# EAGLE design button_control_esp32 (EAGLE 8.6.0)

## Sheet 1 of 7
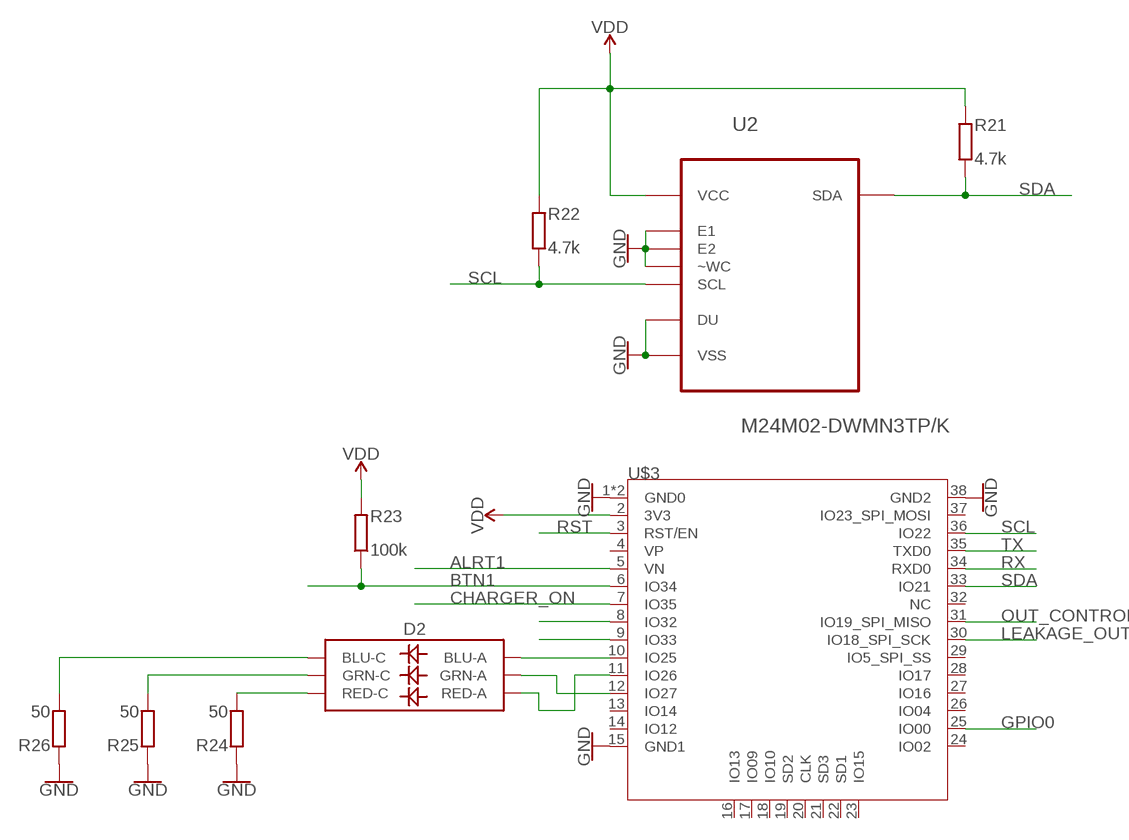
[diagram p0: schematic, sheet 1]

### Parts
D2  LED-RGBNO_IC  [LED-TRICOLOR-5050]
R21  4.7k  R-EU_R0603  [R0603]
R22  4.7k  R-EU_R0603  [R0603]
R23  100k  R-EU_R0603  [R0603]
R24  50  R-EU_R0603  [R0603]
R25  50  R-EU_R0603  [R0603]
R26  50  R-EU_R0603  [R0603]
U2  M24M02-DWMN3TP/K  [SOIC127P600X175-8N]
U$3  ESP32  [TTGO_ESP32]

### Nets
ALRT1: U$3.5(VN) ; also sheet 5
BTN1: R23.1 U$3.6(IO34) ; also sheet 7
CHARGER_ON: U$3.7(IO35) ; also sheet 6
GND [PWR]: R24.2 R25.2 R26.2 U2.1(DU) U2.2(E1) U2.3(E2) U2.4(VSS) U2.7(~WC) U$3.1(GND0) U$3.15(GND1) U$3.38(GND2) U$3.P$1(GND0) ; also sheet 2,3,4,6,7
GPIO0: U$3.25(IO00) ; also sheet 7
LEAKAGE_OUT: U$3.30(IO18_SPI_SCK) ; also sheet 3
N$4: D2.3(BLU-A) U$3.10(IO25)
N$12: D2.1(GRN-A) U$3.12(IO27)
N$19: D2.2(RED-A) U$3.11(IO26)
N$24: U$3.9(IO33)
N$30: U$3.8(IO32)
N$31: D2.4(BLU-C) R26.1
N$33: D2.6(GRN-C) R25.1
N$34: D2.5(RED-C) R24.1
OUT_CONTROL: U$3.31(IO19_SPI_MISO) ; also sheet 6
RST: U$3.3(RST/EN) ; also sheet 7
RX: U$3.34(RXD0) ; also sheet 7
SCL: R22.1 U2.6(SCL) U$3.36(IO22) ; also sheet 5
SDA: R21.1 U2.5(SDA) U$3.33(IO21) ; also sheet 5
TX: U$3.35(TXD0) ; also sheet 7
VDD [PWR]: R21.2 R22.2 R23.2 U2.8(VCC) U$3.2(3V3) ; also sheet 2,3,6,7
Unconnected: U$3.4(VP) U$3.13(IO14) U$3.14(IO12) U$3.16(IO13) U$3.17(IO09) U$3.18(IO10) U$3.19(SD2) U$3.20(CLK) U$3.21(SD3) U$3.22(SD1) U$3.23(IO15) U$3.24(IO02) U$3.26(IO04) U$3.27(IO16) U$3.28(IO17) U$3.29(IO5_SPI_SS) U$3.32(NC) U$3.37(IO23_SPI_MOSI)

## Sheet 2 of 7: POWER
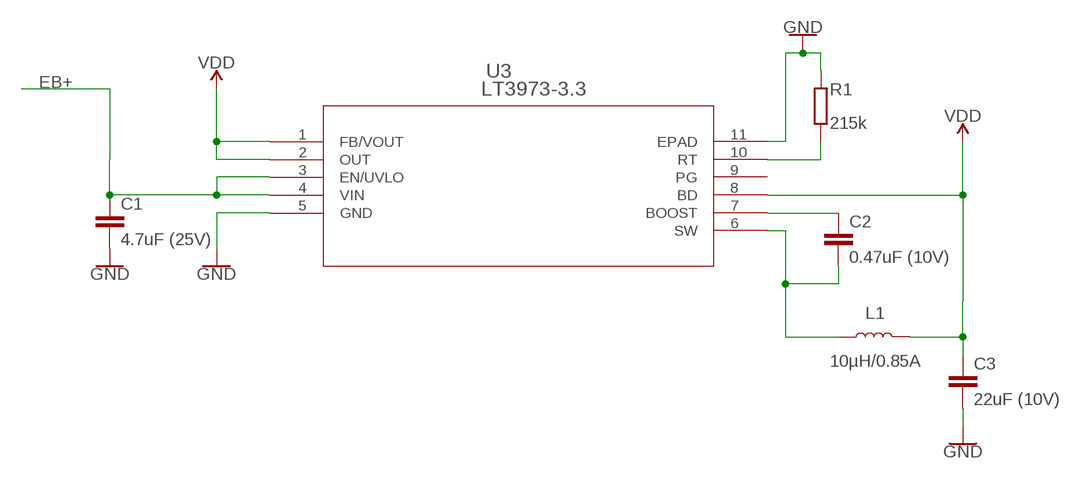
[diagram p1: schematic, sheet 2]

### Parts
C1  4.7uF (25V)  C-EUC1206  [C1206]
C2  0.47uF (10V)  C-EUC0603K  [C0603K]
C3  22uF (10V)  C-EUC1206  [C1206]
L1  10µH/0.85A  INDUCTOR-CDRH-4.7UH  [INDUCTOR_4.7UH]
R1  215k  R-EU_R0603  [R0603]
U3  LT3973-3.3  LT3973IDDPBF  [DFN-10_DD]

### Nets
BOOST: C2.1 U3.7(BOOST)
EB+: C1.1 U3.3(EN/UVLO) U3.4(VIN) ; also sheet 3,4,6,7
GND [PWR]: C1.2 C3.2 R1.2 U3.5(GND) U3.11(EPAD) ; also sheet 1,3,4,6,7
RT: R1.1 U3.10(RT)
SW [PWR]: C2.2 L1.P$1 U3.6(SW)
VDD [PWR]: C3.1 L1.P$2 U3.1(FB/VOUT) U3.2(OUT) U3.8(BD) ; also sheet 1,3,6,7
Unconnected: U3.9(PG)

## Sheet 3 of 7: LEAKAGE
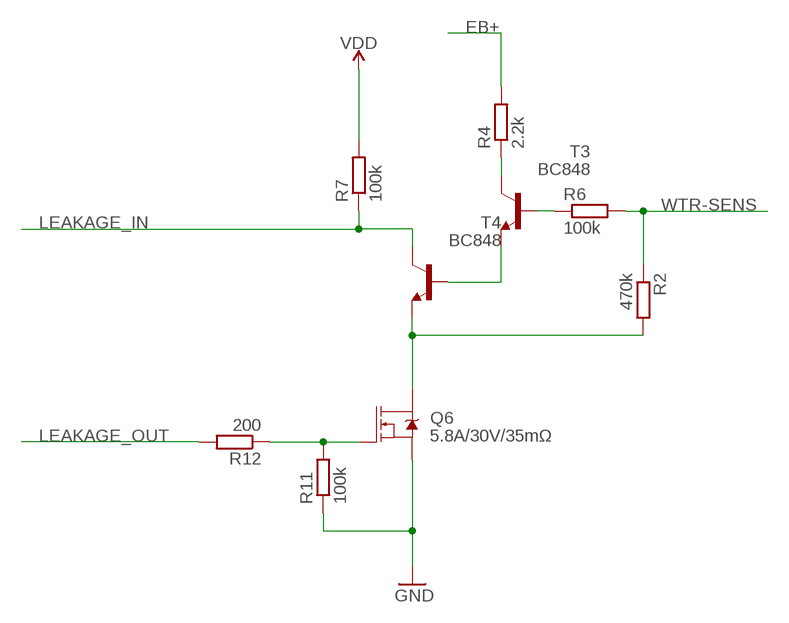
[diagram p2: schematic, sheet 3]

### Parts
Q6  5.8A/30V/35mΩ  MOSFET-NCH-AO3404A  [SOT23-3]
R2  470k  R-EU_R0603  [R0603]
R4  2.2k  R-EU_R0603  [R0603]
R6  100k  R-EU_R0603  [R0603]
R7  100k  R-EU_R0603  [R0603]
R11  100k  R-EU_R0603  [R0603]
R12  200  R-EU_R0603  [R0603]
T3  BC848  [SOT23]
T4  BC848  [SOT23]

### Nets
EB+: R4.2 ; also sheet 2,4,6,7
GND [PWR]: Q6.2(S) R11.1 ; also sheet 1,2,4,6,7
LEAKAGE_IN: R7.1 T4.3(C)
LEAKAGE_OUT: R12.2 ; also sheet 1
N$1: T3.2(E) T4.1(B)
N$2: R6.1 T3.1(B)
N$3: Q6.3(D) R2.2 T4.2(E)
VDD [PWR]: R7.2 ; also sheet 1,2,6,7
WTR-SENS: R2.1 R6.2 ; also sheet 7
WTR_MEASURE_ON1: Q6.1(G) R11.2 R12.1
WTR_MEASURE_PULLUP1: R4.1 T3.3(C)

## Sheet 4 of 7: BMS
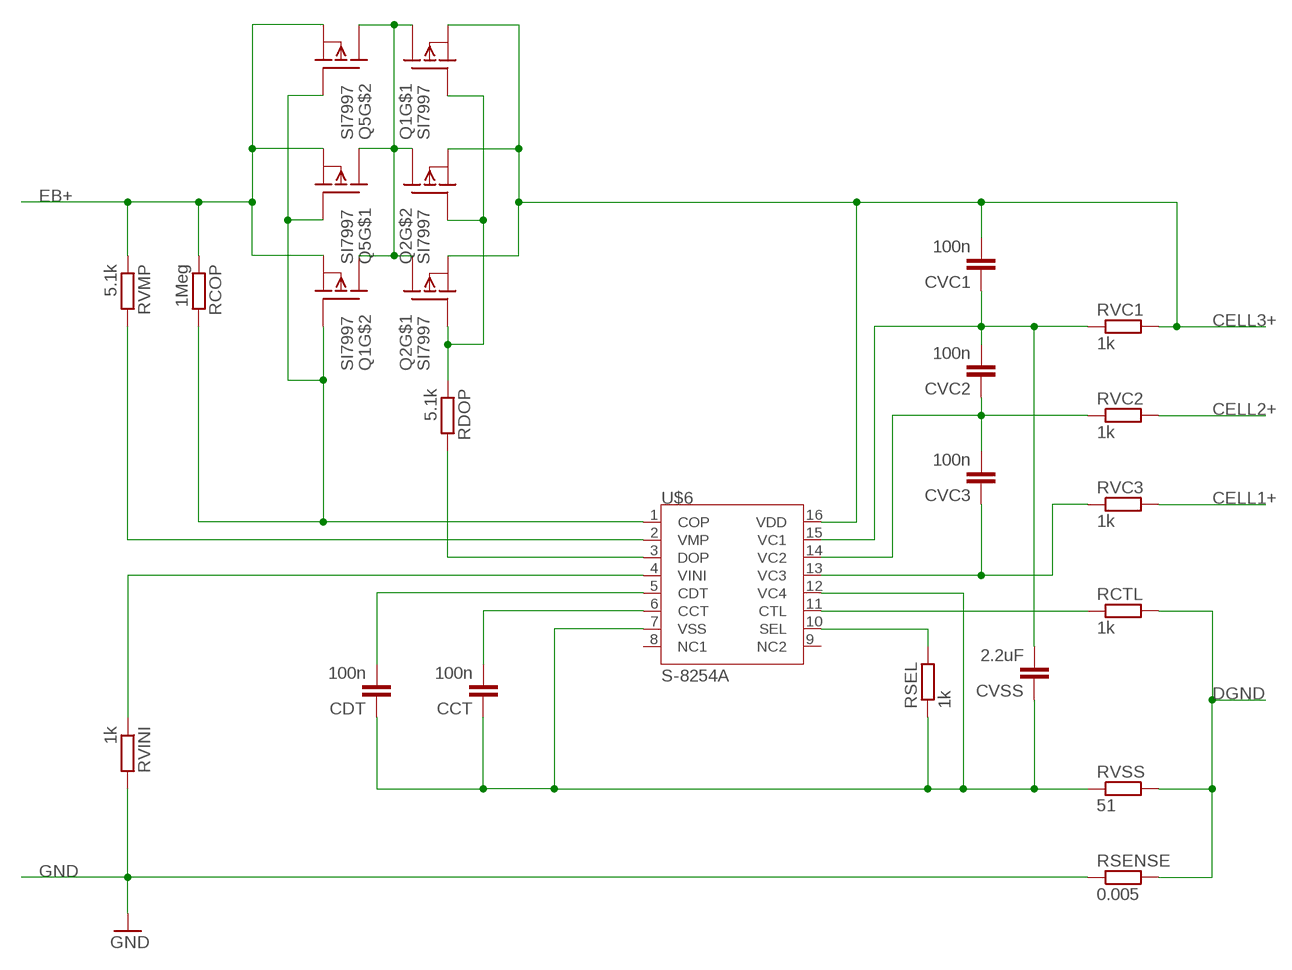
[diagram p3: schematic, sheet 4]

### Parts
CCT  100n  C-EUC0603  [C0603]
CDT  100n  C-EUC0603  [C0603]
CVC1  100n  C-EUC0603  [C0603]
CVC2  100n  C-EUC0805K  [C0805K]
CVC3  100n  C-EUC0603  [C0603]
CVSS  2.2uF  C-EUC0805  [C0805]
Q1  SI7997  [POWERPAK]
Q2  SI7997  [POWERPAK]
Q5  SI7997  [POWERPAK]
RCOP  1Meg  R-EU_R0603  [R0603]
RCTL  1k  R-EU_R0603  [R0603]
RDOP  5.1k  R-EU_R0603  [R0603]
RSEL  1k  R-EU_R0603  [R0603]
RSENSE  0.005  R-EU_R2010  [R2010]
RVC1  1k  R-EU_R0603  [R0603]
RVC2  1k  R-EU_R0603  [R0603]
RVC3  1k  R-EU_R0603  [R0603]
RVINI  1k  R-EU_R0603  [R0603]
RVMP  5.1k  R-EU_R0603  [R0603]
RVSS  51  R-EU_R0603  [R0603]
U$6  S-8254A  [TSSOP-16]

### Nets
CELL1+: RVC3.2 ; also sheet 5,7
CELL2+: RVC2.2 ; also sheet 5,7
CELL3+: CVC1.2 Q1.1(S) Q2.1(S) Q2.3(S) RVC1.2 U$6.16(VDD) ; also sheet 5,7
DGND: RCTL.2 RSENSE.2 RVSS.2 ; also sheet 5,7
EB+: Q1.3(S) Q5.1(S) Q5.3(S) RCOP.1 RVMP.1 ; also sheet 2,3,6,7
GND [PWR]: RSENSE.1 RVINI.2 ; also sheet 1,2,3,6,7
N$8: RDOP.2 U$6.3(DOP)
N$9: Q1.4(G) Q5.2(G) Q5.4(G) RCOP.2 U$6.1(COP)
N$10: Q1.2(G) Q2.2(G) Q2.4(G) RDOP.1
N$17: RVMP.2 U$6.2(VMP)
N$18: RSEL.2 U$6.10(SEL)
N$20: RVINI.1 U$6.4(VINI)
N$21: CDT.2 U$6.5(CDT)
N$22: CCT.2 U$6.6(CCT)
N$23: CCT.1 CDT.1 CVSS.1 RSEL.1 RVSS.1 U$6.7(VSS) U$6.12(VC4)
N$25: RCTL.1 U$6.11(CTL)
N$26: Q1.5(D) Q1.5_6(D) Q1.6(D) Q1.7(D) Q1.7_8(D) Q1.8(D) Q2.5(D) Q2.5_6(D) Q2.6(D) Q2.7(D) Q2.7_8(D) Q2.8(D) Q5.5(D) Q5.5_6(D) Q5.6(D) Q5.7(D) Q5.7_8(D) Q5.8(D)
N$27: CVC3.1 RVC3.1 U$6.13(VC3)
N$28: CVC2.1 CVC3.2 RVC2.1 U$6.14(VC2)
N$29: CVC1.1 CVC2.2 CVSS.2 RVC1.1 U$6.15(VC1)
Unconnected: U$6.8(NC1) U$6.9(NC2)

## Sheet 5 of 7: GAUGE
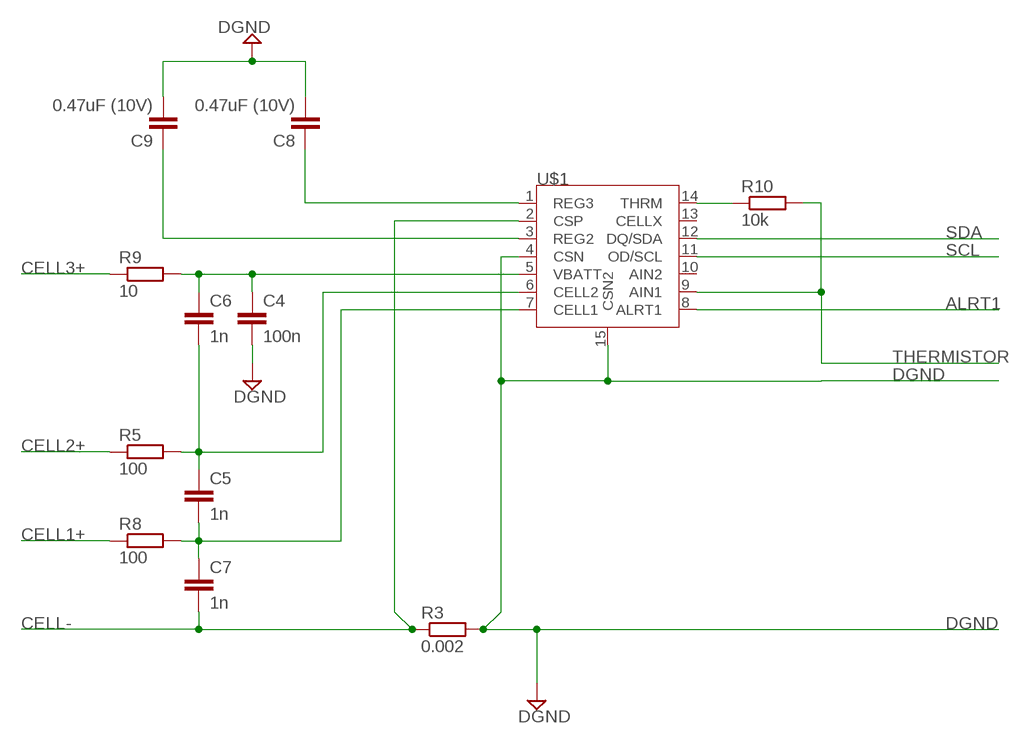
[diagram p4: schematic, sheet 5]

### Parts
C4  100n  C-EUC0603  [C0603]
C5  1n  C-EUC0603  [C0603]
C6  1n  C-EUC0603  [C0603]
C7  1n  C-EUC0603  [C0603]
C8  0.47uF (10V)  C-EUC0603K  [C0603K]
C9  0.47uF (10V)  C-EUC0603K  [C0603K]
R3  0.002  R-EU_R2010  [R2010]
R5  100  R-EU_R0805  [R0805]
R8  100  R-EU_R0805  [R0805]
R9  10  R-EU_R0603  [R0603]
R10  10k  R-EU_R0603  [R0603]
U$1  MAX17205G  [SON40P300X300X80-15N230X170]

### Nets
ALRT1: U$1.8(ALRT1) ; also sheet 1
CELL1+: R8.1 ; also sheet 4,7
CELL2+: R5.1 ; also sheet 4,7
CELL3+: R9.1 ; also sheet 4,7
CELL-: C7.2 R3.1 U$1.2(CSP) ; also sheet 7
DGND: C4.2 C8.2 C9.2 R3.2 U$1.4(CSN) U$1.15(CSN2) ; also sheet 4,7
N$5: C4.1 C6.1 R9.2 U$1.5(VBATT)
N$6: C5.1 C6.2 R5.2 U$1.6(CELL2)
N$7: C5.2 C7.1 R8.2 U$1.7(CELL1)
N$11: R10.1 U$1.14(THRM)
N$13: C8.1 U$1.1(REG3)
N$14: C9.1 U$1.3(REG2)
SCL: U$1.11(OD/SCL) ; also sheet 1
SDA: U$1.12(DQ/SDA) ; also sheet 1
THERMISTOR: R10.2 U$1.9(AIN1) ; also sheet 7
Unconnected: U$1.10(AIN2) U$1.13(CELLX)

## Sheet 6 of 7: SWITCH
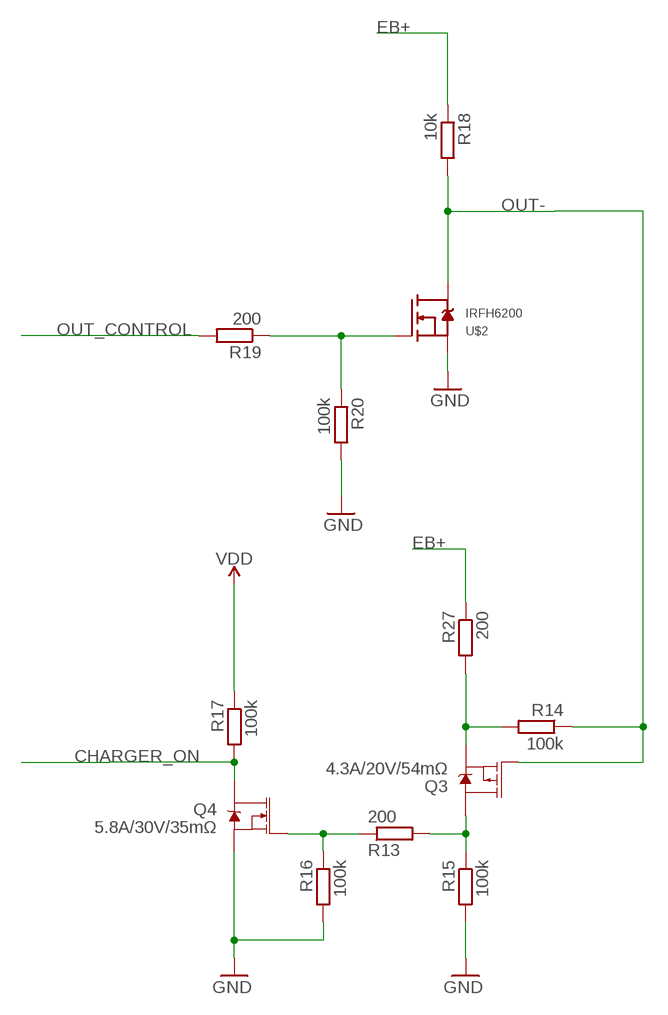
[diagram p5: schematic, sheet 6]

### Parts
Q3  4.3A/20V/54mΩ  MOSFET_PCH-IRLML2244  [SOT23-3]
Q4  5.8A/30V/35mΩ  MOSFET-NCH-AO3404A  [SOT23-3]
R13  200  R-EU_R0603  [R0603]
R14  100k  R-EU_R0603  [R0603]
R15  100k  R-EU_R0603  [R0603]
R16  100k  R-EU_R0603  [R0603]
R17  100k  R-EU_R0603  [R0603]
R18  10k  R-EU_R0603  [R0603]
R19  200  R-EU_R0603  [R0603]
R20  100k  R-EU_R0603  [R0603]
R27  200  R-EU_R0603  [R0603]
U$2  IRFH6200  [PQFN]

### Nets
CHARGER_ON: Q4.3(D) R17.2 ; also sheet 1
EB+: R18.1 R27.1 ; also sheet 2,3,4,7
GND [PWR]: Q4.2(S) R15.2 R16.2 R20.2 U$2.1(S) U$2.2(S) U$2.3(S) ; also sheet 1,2,3,4,7
N$15: Q3.3(D) R13.2 R15.1
N$16: Q4.1(G) R13.1 R16.1
N$32: Q3.2(S) R14.2 R27.2
OUT-: Q3.1(G) R14.1 R18.2 U$2.5(D) U$2.6(D) U$2.7(D) U$2.8(D) U$2.9(D) ; also sheet 7
OUT_BASE: R19.1 R20.1 U$2.4(G)
OUT_CONTROL: R19.2 ; also sheet 1
VDD [PWR]: R17.1 ; also sheet 1,2,3,7

## Sheet 7 of 7: CONN
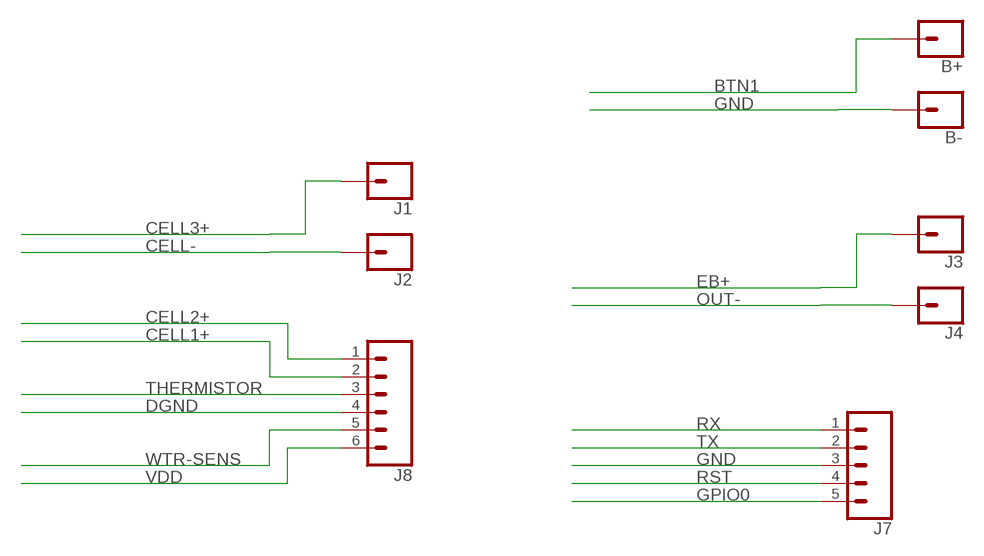
[diagram p6: schematic, sheet 7]

### Parts
B+  CONN_01  [1X01]
B-  CONN_01  [1X01]
J1  CONN_01PTH_2MM  [1X01_2MM]
J2  CONN_01PTH_2MM  [1X01_2MM]
J3  CONN_01PTH_2MM  [1X01_2MM]
J4  CONN_01PTH_2MM  [1X01_2MM]
J7  CONN_051.27MM  [1X05_1.27MM]
J8  CONN_061.27MM  [1X06_1.27MM]

### Nets
BTN1: B+.1 ; also sheet 1
CELL1+: J8.2 ; also sheet 4,5
CELL2+: J8.1 ; also sheet 4,5
CELL3+: J1.1 ; also sheet 4,5
CELL-: J2.1 ; also sheet 5
DGND: J8.4 ; also sheet 4,5
EB+: J3.1 ; also sheet 2,3,4,6
GND [PWR]: B-.1 J7.3 ; also sheet 1,2,3,4,6
GPIO0: J7.5 ; also sheet 1
OUT-: J4.1 ; also sheet 6
RST: J7.4 ; also sheet 1
RX: J7.1 ; also sheet 1
THERMISTOR: J8.3 ; also sheet 5
TX: J7.2 ; also sheet 1
VDD [PWR]: J8.6 ; also sheet 1,2,3,6
WTR-SENS: J8.5 ; also sheet 3

## Library data of the parts
B+ B- J1-J4 = SparkFun-Connectors:CONN_01: Single connection point. Often used as Generic Header-pin footprint for 0.1 inch spaced/style header connections On any of the 0.1 inch spaced packages, you can populate with these: Break Away Headers - Straight <https://www.sparkfun.com/products/116> (PRT-00116) Break Away Male Headers - Right Angle <https://www.sparkfun.com/products/553> (PRT-00553) Female Headers <https://www.sparkfun.com/products/115> (PRT-00115) Break Away Headers - Machine Pin <https://www.sparkfun.com/products/117> (PRT-00117) Break Away Female Headers - Swiss Machine Pin <https://www.sparkfun.com/products/743> (PRT-00743) This device is also useful as a general connection point to wire up your design to another part of your project. Our various solder wires solder well into these plated through hole pads. Hook-Up Wire - Assortment (Stranded, 22 AWG) <https://www.sparkfun.com/products/11375> (PRT-11375) Hook-Up Wire - Assortment (Solid Core, 22 AWG) <https://www.sparkfun.com/products/11367> (PRT-11367) View the entire wire category on our website here <https://www.sparkfun.com/categories/141> Special notes: SMTSO-256-ET is a "flush mount" nut for a 4-40 screw. We mostly use this on specialty testbeds; it is a nice way to connect hardware to your PCB at an adjustable hieght. Also note, the SNAP packages are for using a snappable style connector. We sell a baggie of snaps and they are also used on two LilyPad designs: Snap Assortment - 30 pack (male and female) <https://www.sparkfun.com/products/11347> (DEV-11347) LilyPad Arduino SimpleSnap <https://www.sparkfun.com/products/10941> (DEV-10941) LilyPad SimpleSnap Protoboard <https://www.sparkfun.com/products/10940> (DEV-10940)
C1-C9 CCT CDT CVC1-CVC3 CVSS = resistor:C-EU: CAPACITOR, European symbol
D2 = SparkFun-LED:LED-RGB: LED-RGB 6 pin RGB LED (no common connector) Packages: PLCC-6 LED-TRICOLOR-5050 - No built-in IC SparkFun Products: Digital Sandbox <https://www.sparkfun.com/products/12651> LED- SMD RGB <https://www.sparkfun.com/products/10866>; PROD_ID: DIO-10298
J7 = SparkFun-Connectors:CONN_05: Multi connection point. Often used as Generic Header-pin footprint for 0.1 inch spaced/style header connections On any of the 0.1 inch spaced packages, you can populate with these: Break Away Headers - Straight <https://www.sparkfun.com/products/116> (PRT-00116) Break Away Male Headers - Right Angle <https://www.sparkfun.com/products/553> (PRT-00553) Female Headers <https://www.sparkfun.com/products/115> (PRT-00115) Break Away Headers - Machine Pin <https://www.sparkfun.com/products/117> (PRT-00117) Break Away Female Headers - Swiss Machine Pin <https://www.sparkfun.com/products/743> (PRT-00743) For SCREWTERMINALS and SPRING TERMINALS visit here: Screw Terimnals on SparkFun.com <https://www.sparkfun.com/search/results?term=Screw+Terminals> (5mm/3.5mm/2.54mm spacing) This device is also useful as a general connection point to wire up your design to another part of your project. Our various solder wires solder well into these plated through hole pads. Hook-Up Wire - Assortment (Stranded, 22 AWG) <https://www.sparkfun.com/products/11375> (PRT-11375) Hook-Up Wire - Assortment (Solid Core, 22 AWG) <https://www.sparkfun.com/products/11367> (PRT-11367) View the entire wire category on our website here <https://www.sparkfun.com/categories/141> Special notes: Molex polarized connector foot print use with SKU : PRT-08231 with associated crimp pins and housings. 1MM SMD Version SKU: PRT-10208
J8 = SparkFun-Connectors:CONN_06: Multi connection point. Often used as Generic Header-pin footprint for 0.1 inch spaced/style header connections On any of the 0.1 inch spaced packages, you can populate with these: Break Away Headers - Straight <https://www.sparkfun.com/products/116> (PRT-00116) Break Away Male Headers - Right Angle <https://www.sparkfun.com/products/553> (PRT-00553) Female Headers <https://www.sparkfun.com/products/115> (PRT-00115) Break Away Headers - Machine Pin <https://www.sparkfun.com/products/117> (PRT-00117) Break Away Female Headers - Swiss Machine Pin <https://www.sparkfun.com/products/743> (PRT-00743) Arduino Stackable Header - 6 Pin <https://www.sparkfun.com/products/9280> (PRT-09280) For SCREWTERMINALS and SPRING TERMINALS visit here: Screw Terimnals on SparkFun.com <https://www.sparkfun.com/search/results?term=Screw+Terminals> (5mm/3.5mm/2.54mm spacing) This device is also useful as a general connection point to wire up your design to another part of your project. Our various solder wires solder well into these plated through hole pads. Hook-Up Wire - Assortment (Stranded, 22 AWG) <https://www.sparkfun.com/products/11375> (PRT-11375) Hook-Up Wire - Assortment (Solid Core, 22 AWG) <https://www.sparkfun.com/products/11367> (PRT-11367) View the entire wire category on our website here <https://www.sparkfun.com/categories/141>
L1 = SparkFun-Coils:INDUCTOR: Inductors Resist changes in electrical current. Basically a coil of wire. SparkFun Products: SparkFun Load Cell Amplifier - HX711 <https://www.sparkfun.com/products/13879> IOIO-OTG - V2.2 <https://www.sparkfun.com/products/13613>; PN: CDRH2D18/HPNP-100NC; PROD_ID: NDUC-10146; VALUE: 4.7µH/±30%/1.2A
Q1 Q2 Q5 = SI7997:SI7997: P-Channel Enhancement MOSFET -60V; 60A; 0,020Ohm
Q3 = SparkFun-DiscreteSemi:MOSFET_PCH: P-channel MOSFETs Voltage controlled devices that allow control of high current outputs. SparkFun Products: SparkFun ESP32 Thing <https://www.sparkfun.com/products/13907> SparkFun ESP8266 Thing <https://www.sparkfun.com/products/13231>; PROD_ID: TRANS-11153
Q4 Q6 = SparkFun-DiscreteSemi:MOSFET-NCH: N-channel MOSFETs Voltage controlled devices that allow control of high current outputs. SparkFun Products: SparkFun OpenScale <https://www.sparkfun.com/products/13261> SparkFun Digital Sandbox <https://www.sparkfun.com/products/12651> SparkFun Monster Moto Shield <https://www.sparkfun.com/products/10182> SparkFun MOSFET Power Controller <https://www.sparkfun.com/products/11214>; PROD_ID: TRANS-12988
R1 R3 R5 R8-R10 R21-R26 RCOP RCTL RDOP RSEL RSENSE RVC1-RVC3 RVINI RVMP RVSS = resistor:R-EU_: RESISTOR, European symbol
R2 R4 R6 R7 R11-R20 R27 = rcl:R-EU_: RESISTOR, European symbol; SPICEPREFIX: R
T3 = transistor-neu-to92:BC848: NPN TRANSISTOR
T4 = transistor-neu-to92:BC848: NPN TRANSISTOR; SPICEPREFIX: Q
U2 = M24M02-DWMN3TP_K:M24M02-DWMN3TP/K: 1 Mbit serial I²C bus EEPROM; DESCRIPTION: Automotive 2-Mbit serial I²C bus EEPROM with 1 MHz clock; DIGI-KEY_PART_NUMBER: 497-16238-1-ND; DIGI-KEY_PURCHASE_URL: https://www.digikey.com.ua/product-detail/en/stmicroelectronics/M24M02-DWMN3TP-K/497-16238-1-ND/5764577?utm_source=snapeda&utm_medium=aggregator&utm_campaign=symbol; MF: STMicroelectronics; MP: M24M02-DWMN3TP/K; PACKAGE: SO-8 STMicroelectronics
U3 = LT3973IDDPBF:LT3973IDDPBF; DESCRIPTION: LT3973 - 42V, 750mA Step-Down Regulator with 2.5μA Quiescent Current and Integrated Diodes; DIGI-KEY_PART_NUMBER: LT3973IDD#PBF-ND; DIGI-KEY_PURCHASE_URL: https://www.digikey.com.ua/product-detail/en/linear-technology-analog-devices/LT3973IDD-PBF/LT3973IDD-PBF-ND/2786019?utm_source=snapeda&utm_medium=aggregator&utm_campaign=symbol; MF: Linear Technology; MP: LT3973IDD#PBF; PACKAGE: DFN-10 Linear Technology
U$1 = SON40P300X300X80-15N230X170:MAX17205G
U$2 = IRFH6200:IRFH6200
U$3 = esp32_ttgo:ESP32
U$6 = S8254A:S-8254A

## Net classes
0 default: width 0.152 mm, drill 0.3 mm, clearance 0.152 mm
1 PWR: width 0.381 mm, drill 0.4 mm, clearance 0.152 mm

## Board
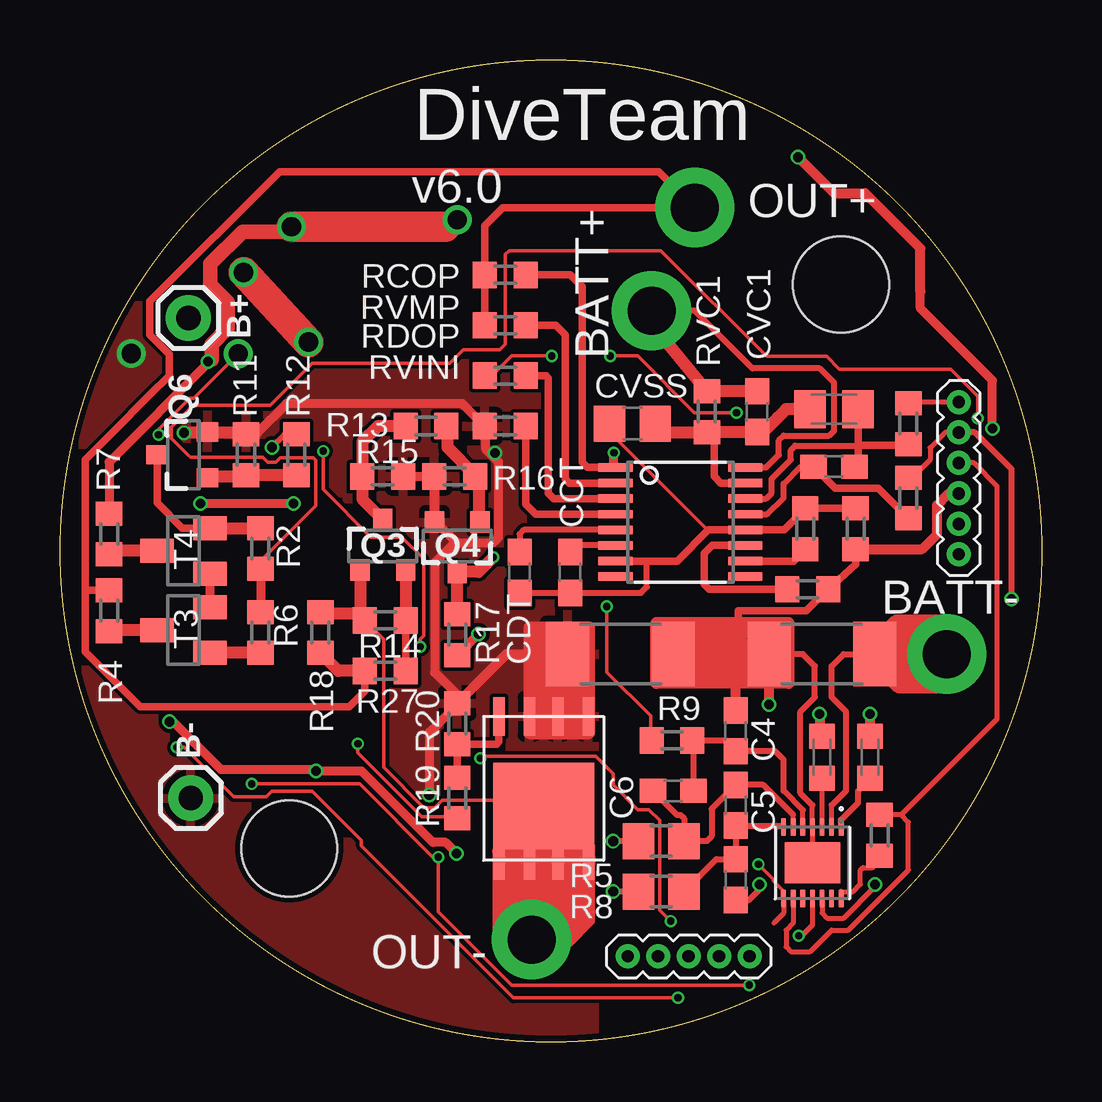
[diagram p7: board, top side]
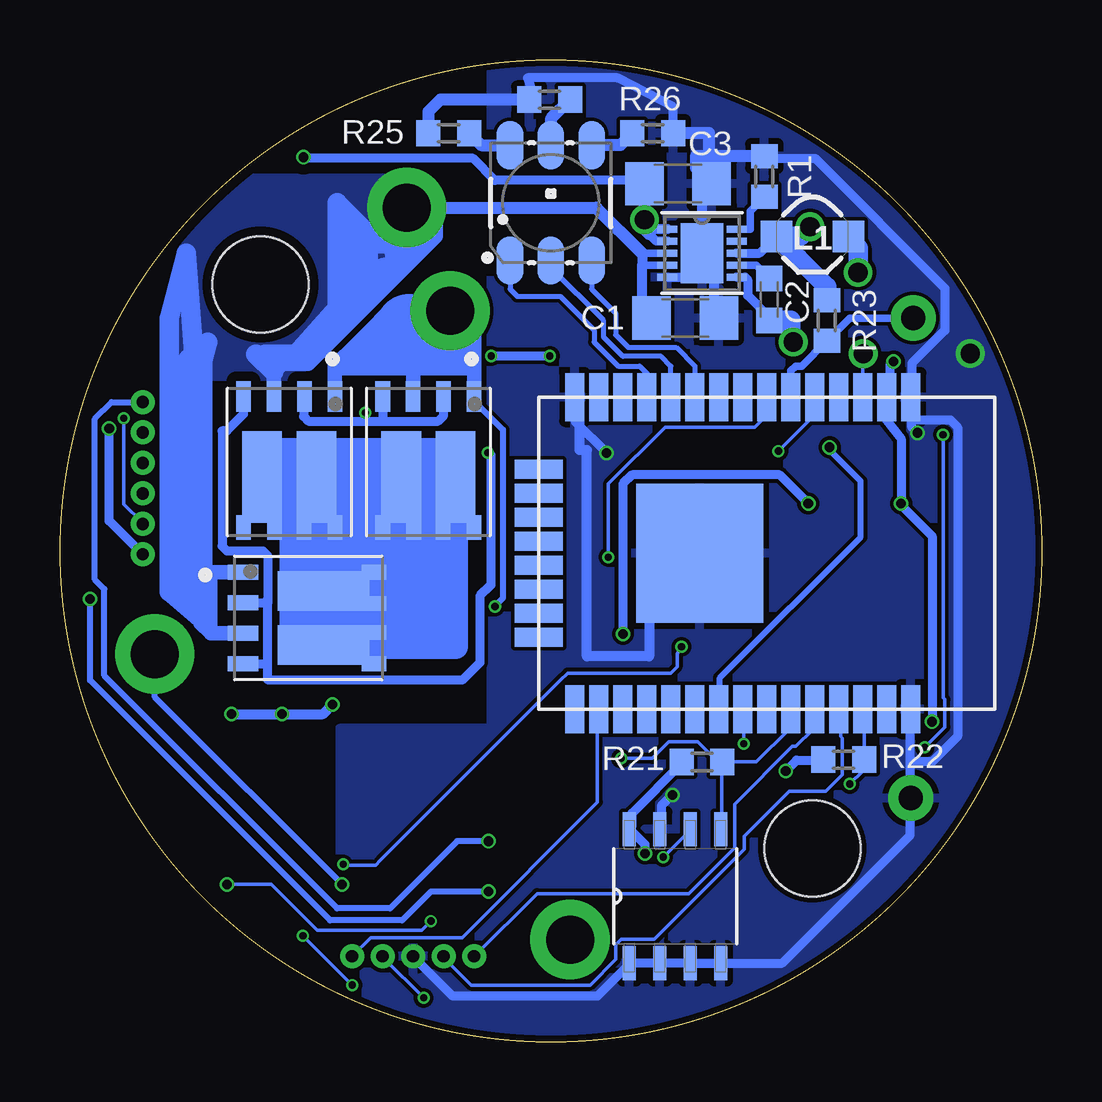
[diagram p8: board, bottom side, seen from below]

Size 40.9 x 40.9 mm. Coordinates in mm from the lower left corner, seen from the top.
Outline: circle at 20.45,20.45 radius 20.45
Copper layers (1*16): Top 0.035mm / dielectric 1.2mm / Bottom 0.035mm
Design rules "SeeedStudio_4layer_DRU_no_angle_20140221 *": minimum track width 6mil, minimum drill 0.3mm, track to track 6mil, track to pad 6mil, pad to pad 6mil, via to via 6mil, smd to smd 0mil, copper to edge 10mil, drill to drill 8mil, minimum pad ring 6mil, minimum via ring 4mil, stop-mask expansion 4mil, vias tented up to drill 25mil, thermal gap 10mil
Holes 4 mm at 32.55,31.55 9.55,8.05

### Footprints (pad centres in the part's own frame; a part is rotated, then mirrored left to right if it is on the bottom)
1X01 = drill 1.016 pad 1.88: 1 0,0
C1206 = smd 1.6 x 1.8: 1 -1.4,0; 2 1.4,0
C0603K = smd 1.05 x 1.08: 1 -0.875,0; 2 0.875,0
C0603 = smd 1.1 x 1: 1 -0.85,0; 2 0.85,0
C0805K = smd 1.3 x 1.6: 1 -1,0; 2 1,0
C0805 = smd 1.3 x 1.5: 1 -0.95,0; 2 0.95,0
LED-TRICOLOR-5050 = smd 2 x 1.1: 1 -2.4,1.7; 2 -2.4,0; 3 -2.4,-1.7; 4 2.4,-1.7; 5 2.4,0; 6 2.4,1.7
1X01_2MM = drill 2 pad 3.302: 1 0,0
1X05_1.27MM = drill 0.508 pad 1: 1 0,0; 2 1.27,0; 3 2.54,0; 4 3.81,0; 5 5.08,0
1X06_1.27MM = drill 0.508 pad 1: 1 0,0; 2 1.27,0; 3 2.54,0; 4 3.81,0; 5 5.08,0; 6 6.35,0
INDUCTOR_4.7UH = smd 1.3 x 1.3: P$1 -1.5,0; P$2 1.5,0
POWERPAK = smd 1.27 x 0.61: 1 -2.732,1.905; 2 -2.732,0.635; 3 -2.732,-0.635; 4 -2.732,-1.905 | smd 1.02 x 0.61: 5 2.732,-1.905; 6 2.732,-0.61; 7 2.732,0.61; 8 2.732,1.905 | smd 3.81 x 1.65: 5_6 0.627,-1.13; 7_8 0.627,1.13
SOT23-3 = smd 0.8 x 0.9: 1 -0.95,-1; 2 0.95,-1; 3 0,1.1
R0603 = smd 1 x 1.1: 1 -0.85,0; 2 0.85,0
R2010 = smd 1.8 x 2.7: 1 -2.2,0; 2 2.2,0
R0805 = smd 1.3 x 1.5: 1 -0.95,0; 2 0.95,0
SOT23 = smd 1 x 1.4: 1 -0.95,-1.1; 2 0.95,-1.1; 3 0,1.1
SOIC127P600X175-8N = smd 1.422 x 0.533: 1 -2.794,1.905; 2 -2.794,0.635; 3 -2.794,-0.635; 4 -2.794,-1.905; 5 2.794,-1.905; 6 2.794,-0.635; 7 2.794,0.635; 8 2.794,1.905
DFN-10_DD = smd 0.813 x 0.305: 1 -1.448,1; 2 -1.448,0.5; 3 -1.448,0; 4 -1.448,-0.5; 5 -1.448,-1; 6 1.448,-1; 7 1.448,-0.5; 8 1.448,0; 9 1.448,0.5; 10 1.448,1 | smd 1.753 x 2.489: 11 0,0
SON40P300X300X80-15N230X170 = smd 0.76 x 0.22: 1 -1.485,1.2; 2 -1.485,0.8; 3 -1.485,0.4; 4 -1.485,0; 5 -1.485,-0.4; 6 -1.485,-0.8; 7 -1.485,-1.2; 8 1.485,-1.2; 9 1.485,-0.8; 10 1.485,-0.4; 11 1.485,0; 12 1.485,0.4; 13 1.485,0.8; 14 1.485,1.2 | smd 1.7 x 2.3: 15 0,0
PQFN = smd 1.6 x 0.48: 1 -3,1.865; 2 -3,0.595; 3 -3,-0.595; 4 -3,-1.865; 5 3,-1.865; 6 3,-0.595; 7 3,0.595; 8 3,1.865 | smd 3.6 x 4.2: 9 0.725,0
TTGO_ESP32 = smd 2 x 0.8: 1 -6.5,6; 2 -6.5,5; 3 -6.5,4; 4 -6.5,3; 5 -6.5,2; 6 -6.5,1; 7 -6.5,0; 8 -6.5,-1; 9 -6.5,-2; 10 -6.5,-3; 11 -6.5,-4; 12 -6.5,-5; 13 -6.5,-6; 14 -6.5,-7; 15 -6.5,-8; 24 6.5,-8; 25 6.5,-7; 26 6.5,-6; 27 6.5,-5; 28 6.5,-4; 29 6.5,-3; 30 6.5,-2; 31 6.5,-1; 32 6.5,0; 33 6.5,1; 34 6.5,2; 35 6.5,3; 36 6.5,4; 37 6.5,5; 38 6.5,6 | smd 0.8 x 2: 16 -3.5,-9.5; 17 -2.5,-9.5; 18 -1.5,-9.5; 19 -0.5,-9.5; 20 0.5,-9.5; 21 1.5,-9.5; 22 2.5,-9.5; 23 3.5,-9.5 | smd 5.8 x 5.3: P$1 0,-2.8
TSSOP-16 = smd 0.35 x 1.43: 1 -2.275,-2.7; 2 -1.625,-2.7; 3 -0.975,-2.7; 4 -0.325,-2.7; 5 0.325,-2.7; 6 0.975,-2.7; 7 1.625,-2.7; 8 2.275,-2.7; 9 2.275,2.7; 10 1.625,2.7; 11 0.975,2.7; 12 0.325,2.7; 13 -0.325,2.7; 14 -0.975,2.7; 15 -1.625,2.7; 16 -2.275,2.7

### Placement (x,y rotation side)
B+  5.35,30.15 0 top
B-  5.45,10.15 0 top
C1  14.85,30.15 0 bottom
C2  11.35,30.93 270 bottom
C3  15.15,35.75 0 bottom
C4  28.15,12.95 90 top
C5  28.15,9.85 270 top
C6  25.55,10.45 180 top
C7  28.15,6.75 270 top
C8  33.75,11.85 90 top
C9  31.75,11.85 90 top
CCT  21.25,19.55 90 top
CDT  19.15,19.55 90 top
CVC1  29.05,26.25 90 top
CVC2  32.25,26.35 180 top
CVC3  32.25,23.95 0 top
CVSS  23.85,25.75 0 top
D2  20.45,34.95 90 bottom
J1  24.65,30.45 0 bottom
J2  36.95,16.15 270 top
J3  26.45,34.75 0 bottom
J4  19.65,4.25 270 top
J7  23.65,3.55 0 top
J8  37.45,26.65 270 top
L1  9.55,33.55 180 bottom
Q1  31.35,24.15 270 bottom
Q2  25.55,24.15 270 bottom
Q3  13.45,20.65 0 top
Q4  16.55,20.65 180 top
Q5  30.55,17.65 0 bottom
Q6  5.15,24.45 90 top
R1  11.55,36.05 90 bottom
R2  8.35,20.55 90 top
R3  31.75,16.15 180 top
R4  2.05,17.95 90 top
R5  25.05,8.35 0 top
R6  8.35,17.05 90 top
R7  2.05,21.15 90 top
R8  25.05,6.25 0 top
R9  25.5,12.55 0 top
R10  34.15,8.6 90 top
R11  7.75,24.45 270 top
R12  9.85,24.45 90 top
R13  15.25,25.65 180 top
R14  13.55,17.55 0 top
R15  13.45,23.55 0 top
R16  16.45,23.55 180 top
R17  16.55,16.95 90 top
R18  10.85,17.05 90 top
R19  16.55,10.15 270 top
R20  16.55,13.25 90 top
R21  14.15,11.65 180 bottom
R22  8.25,11.75 180 bottom
R23  8.95,30.05 90 bottom
R24  20.5,39.25 180 bottom
R25  24.7,37.85 180 bottom
R26  16.2,37.85 0 bottom
R27  13.55,15.45 0 top
RCOP  18.55,31.95 0 top
RCTL  31.15,18.85 0 top
RDOP  18.55,27.75 0 top
RSEL  31.05,21.37 270 top
RSENSE  23.35,16.15 0 top
RVC1  26.95,26.25 90 top
RVC2  35.35,25.75 90 top
RVC3  35.35,22.65 90 top
RVINI  18.55,25.65 180 top
RVMP  18.55,29.85 0 top
RVSS  33.15,21.37 270 top
T3  5.15,17.15 90 top
T4  5.15,20.45 90 top
U2  15.27,6.06 90 bottom
U3  14.15,32.85 0 bottom
U$1  31.35,7.45 270 top
U$2  20.15,10.55 270 top
U$3  11.45,20.35 270 bottom
U$6  25.85,21.65 270 top

### Tracks (layer width: path | path; a pad name or v marks a point on that pad's centre or on a via)
ALRT1  (via drill 0.3)
  Top 0.152: v29.1,7.38 29.71,6.77 29.71,6.7 30.09,6.32 30.09,6.01 U$1.8 | v15,16.45 15,16.76 15.16,16.91 15.16,20.11 14.24,21.02 12.95,21.02 10.97,23 v10.97,24.61
  Top 0.203: U$1.8 30.15,5.35 29.75,4.95
  Bottom 0.152: v29.1,7.38 29.05,7.38 28.98,7.38 28.95,7.35 27.75,7.35 27.55,7.55 20.05,15.05 19.75,15.35 15.45,15.35 15.19,15.61 15.19,16.15 v15,16.45 | v10.97,24.61 9.52,26.05 9.52,26.81 U$3.5
BOOST
  Bottom 0.305: U3.7 11.9,32.35 C2.1
BTN1
  Bottom 0.305: U$3.6 10.45,27.95 10.25,28.15 10,28.15 R23.1 8,30.15 B+.1
CELL1+  (via drill 0.4)
  Top 0.203: J8.2 36.88,25.38 36.25,24.75 36.25,24.25 35.5,23.5 RVC3.2
  Top 0.254: R8.1 v23.05,6.25 | v39.65,18.45 39.65,19.05 39.65,23.85 38.12,25.38 J8.2
  Bottom 0.254: v23.05,6.25 25.45,6.25 26.65,5.05 29.65,5.05 39.65,15.05 39.65,18.35 v39.65,18.45
CELL2+  (via drill 0.4)
  Top 0.203: J8.1 35.4,26.65 RVC2.2
  Top 0.254: R5.1 v23.05,8.35
  Bottom 0.254: v23.05,8.35 24.35,8.35 27.15,5.55 29.35,5.55 39.05,15.25 39.05,18.85 39.45,19.25 39.45,25.95 38.75,26.65 J8.1
CELL3+  (via drill 0.3)
  Top 0.152: v22.78,18.13 22.78,15.4 24.61,13.57 24.61,12.57 R9.1
  Top 0.254: U$6.16 29.43,23.93 29.95,24.45 29.95,25.05 30.15,25.25 32.05,25.25 32.25,25.45 32.25,27.45 31.65,28.05 28.85,28.05 26.45,30.45 J1.1
  Top 0.508: J1.1 24.65,29.9 RVC1.2 28.55,27.1 CVC1.2
  Bottom 0.152: 22.78,18.15 v22.78,18.13 | 23.54,26.59 Q2.1
  Bottom 0.254: 22.78,18.15 22.45,18.48 22.45,25.5 23.54,26.59
  Bottom 0.61: Q2.1 23.65,28.35 24.15,28.85 24.15,28.95 23.65,29.45 23.65,29.75 23.64,29.75 23.64,28.04 25.35,29.75 26.18,28.91 Q2.3 | Q1.1 29.45,27.65 29.45,28.15 29.35,28.25 | 26.35,29.75 27.35,29.75 27.35,29.45 26.55,28.65 26.55,29.95 27.05,30.55 28.15,29.45 28.95,28.65 | 29.35,28.25 29.05,28.55 | 29.05,28.55 28.95,28.65 | 28.95,28.65 28.65,28.95 28.15,29.05 27.65,29.05 27.75,29.15 27.75,29.45 28.35,28.85 28.45,28.85 28.35,28.75 27.15,28.75 29.25,28.05 26.45,28.05 24.25,28.05 24.75,28.55 24.85,28.55 24.35,28.05 23.95,28.05 24.15,28.05 24.25,28.15 24.95,28.15 25.05,28.25 26.45,28.25 26.65,28.45 29.35,28.25 | 29.35,28.25 29.05,28.55 | 29.05,28.55 28.95,28.65
  Bottom 2.8: J1.1 25.35,29.75 26.35,29.75
CELL-  (via drill 0.4)
  Top 0.203: U$1.2 32.15,9.85
  Top 0.254: 32.15,9.85 32.75,10.45 32.75,13.75 32.15,14.35 32.15,15.65 32.65,16.15 R3.1 | C7.2 28.7,5.9 29.15,6.35 v29.15,6.55
  Top 0.508: R3.1 33.95,16.65 34.85,17.55 36.95,17.55 J2.1 | J2.1 36.95,14.75 34.95,14.75 34.15,15.55 35.05,16.45 35.05,17.15 36.55,17.15 36.65,17.05 36.65,15.25 35.25,15.25 35.15,15.15 34.85,15.45 34.85,16.35 35.35,16.85 36.35,16.85 36.35,15.55 36.25,15.65 35.15,15.65 35.15,16.15 35.45,16.45 35.95,16.45 35.95,15.95 35.55,15.95 35.75,16.15 J2.1
  Bottom 0.254: v29.15,6.55 36.95,14.35 J2.1
CHARGER_ON  (via drill 0.3)
  Top 0.152: 16.68,19.58 Q4.3
  Top 0.508: R17.2 Q4.3 | 16.68,19.58 17.44,19.58 v18.05,20.19
  Bottom 0.152: v18.05,20.19 18.05,23.23 15.69,25.6 11.96,25.6 11.5,26.05 11.5,26.81 U$3.7
DGND  (via drill 0.4)
  Top 0.203: 31.35,9.85 U$1.4 U$1.15
  Top 0.254: 31.35,9.85 30.85,10.35 30.85,13.75 31.45,14.35 31.45,15.65 30.95,16.15 R3.2 | 28.15,15.55 27.95,15.75 | 31.65,12.72 C9.2 | v33.75,13.65 33.75,13.75 v33.75,13.65
  Top 0.305: RVSS.2 33.15,19.9 RCTL.2 31.1,17.95 28.25,17.95 28.25,17.05
  Top 0.406: C4.2 28.15,15.55 | C8.2 v33.75,13.65 | v31.65,13.65 31.65,12.72 | v29.55,14.05 R3.2 | RVSS.2 35.92,20.52 36.55,21.15 36.55,22.35 37.04,22.84 J8.4
  Top 0.508: RSENSE.2 24.85,16.15 24.85,17.45 30.35,17.45 30.35,14.95 24.85,14.95 24.85,17.05 28.25,17.05 | 28.25,17.05 29.05,17.05 28.25,17.05 | 28.25,17.05 26.55,17.05 26.55,15.15 26.55,16.55 28.55,16.55 28.55,15.35 28.55,16.15 26.75,16.15 28.25,16.15 28.25,15.25 28.25,15.75 27.95,15.75 | 27.95,15.75 26.85,15.75 27.95,15.75 | 27.95,15.75 27.95,15.25 27.95,15.45 26.85,15.45 26.85,16.15 R3.2
  Bottom 0.406: v33.75,13.65 v31.65,13.65 29.95,13.65 v29.55,14.05
EB+
  Top 0.254: RCOP.1 17.7,31.75
  Top 0.305: RVMP.1 17.7,31.75 17.7,34 18.45,34.75 J3.1 24.95,36.25 9.15,36.25 3.75,30.85 3.75,29.45 4.35,28.85 4.55,28.65 4.55,27.75 3.75,26.95 2.15,25.35 1.05,24.25 1.05,18.75 | R4.2 1.1,18.8 1.05,18.75 | 1.05,18.75 1.05,16.25 1.85,15.45 3.35,13.95 12.05,13.95 12.7,14.6 R27.1
  Top 0.508: R27.1 11.6,15.45 R18.1
  Bottom 0.305: 16.65,32.85 U3.3 | 16.65,32.35 U3.4 | C1.1 16.65,30.15
  Bottom 0.406: 16.65,32.85 16.65,32.35 16.65,30.15
  Bottom 0.508: J3.1 18.55,34.75 16.65,32.85
  Bottom 0.61: Q1.3 31.98,27.91 31.65,28.25 30.55,28.25 25.25,33.55 25.25,34.75 26.95,34.75 J3.1 | Q5.1 34.75,19.55 | 34.75,19.55 34.86,19.55 34.9,17.5 35.05,19.75 35.05,17.75 | Q5.3 34.61,17.02 34.65,17.05 | 34.65,17.05 34.65,19.45 34.75,19.55 | 34.65,17.05 35.05,17.45 35.05,17.75 | 35.05,17.75 35.65,18.35 35.65,19.45 35.65,28.35 35.55,28.45
  Bottom 0.813: 31.98,27.91 32.75,28.65 32.72,28.65 32.35,28.28 32.35,28.65 31.05,28.65 29.35,30.55 29.35,34.95 27.65,33.25 27.45,33.25 27.05,33.65 25.75,33.65 25.65,33.75 25.65,34.25 26.55,34.25 26.15,33.85 26.15,33.05 27.05,33.05 26.95,32.95 26.95,32.35 27.45,32.25 30.85,28.85 28.85,30.85 28.85,33.75 28.05,32.95 28.05,32.45 28.55,31.95 | 34.9,17.5 36.35,18.75 36.35,30.15 35.65,32.85 35.25,27.55 35.25,19.95 35.15,19.85 35.05,19.85 34.95,19.65 34.95,29.05 34.75,29.15 35.05,27.95 35,27.9 35.55,28.45
  pour Bottom (isolate 0.4, no thermals): 26.25,36.05 35.85,36.05 35.85,27.65 30.75,27.65 30.75,28.35 27.95,31.15
GND  (via drill 0.4, 0.8)
  Top 0.381: v15.38,10.28 15.38,12.87 16.45,13.94 R20.2 16.6,14.39 15.61,15.38 15.61,19.96 16.38,20.72 16.53,20.79 | 6.16,25.37 Q6.2 6.01,25.37 | 7.69,25.37 R11.1 7.92,25.37 8.22,25.37 9.44,26.59 16.76,26.59 17.59,25.75 RVINI.2 17.75,25.6 17.75,24.68 18.01,24.41 | R15.2 14.32,23.54 15.46,23.54 R16.2 | 18.01,24.41 18.28,24.15 18.28,21.02 18.05,20.79 16.53,20.79 | 16.53,20.79 15.77,21.56 Q4.2 | v18.13,24.53 18.01,24.41
  Top 0.406: R16.2 Q4.2 | R20.2 18.6,16.15 20.65,16.15
  Top 0.508: 20.05,12.85 19.55,12.85 U$2.3 19.55,17.25 20.05,17.25 | 20.05,12.85 20.45,12.85 | 20.45,12.85 22.05,12.85 22.05,13.35 | 22.05,13.35 22.05,13.75 | 22.05,13.75 22.05,14.65 | 22.05,14.65 22.05,17.25 20.05,17.25 | RSENSE.1 20.65,16.15 20.05,16.15 | 20.05,16.15 20.05,17.25 | 20.45,13.55 U$2.2 20.75,13.35 21.65,13.35 | 20.45,13.55 20.05,13.55 | 20.05,13.55 20.05,12.85 | 20.05,13.55 20.05,16.15 | 20.45,13.55 20.45,14.15 | 20.45,14.15 20.45,14.65 21.55,14.65 | 21.55,14.65 22.05,14.65 | 21.65,13.35 22.05,13.35 | 21.65,13.35 21.65,13.85 | 21.65,13.85 21.65,14.25 | 21.65,14.25 21.65,14.65 21.55,14.65 | 21.65,14.25 20.45,14.25 20.45,14.15 | 21.65,13.85 20.45,13.85 20.45,12.85 | U$2.1 22.05,13.55 22.05,13.75 | 7.69,25.37 6.16,25.37 | 6.01,25.37 v5.17,25.37
  Bottom 0.381: 13.65,31.95 13.75,31.85 U3.5 | 5.48,11.65 5.48,10.2 B-.1 5.48,9.97 5.48,8.6 10.81,3.27 13.17,3.27 U2.4 13.4,3.27 14.62,3.27 U2.3 14.78,3.27 15.84,3.27 U2.2 16.07,3.27 17.14,3.27 U2.1 17.29,3.12 18.51,1.9 24.53,1.9 26.13,3.5 J7.3 | 5.48,11.65 5.48,13.79 U$3.38 | U$3.1 5.4,26.89 5.4,28.26 4.03,29.63 4.03,31.39 9.44,36.8 11.35,36.8 R1.2 | R24.2 21.18,39.39 21.41,40.15 17.67,40.15 15.35,38.95 15.35,38.02 15.54,38.02 R26.2 | v15.38,10.28 15.84,9.82 15.84,8.91 U2.7 | v18.13,24.53 19.42,25.82 19.42,26.81 U$3.15 | v5.17,25.37 5.4,25.6 5.4,26.66 U$3.1 | 5.48,11.65 5.33,11.65 4.56,11.65 3.5,12.72 3.5,25.6 3.8,25.9 5.25,25.9 U$3.1
  Bottom 0.406: 14,36 14.15,35.85 U3.11 13.65,32.35 13.65,31.95 13.65,30.35 13.55,30.35 C1.2 | U$3.P$1 14.25,18.75 16.35,18.75 16.35,16.05 18.95,16.05 18.95,24.65 19.25,24.65 19.25,26.81 19.42,26.81
  Bottom 0.508: R24.2 25.05,39.25 25.55,38.75 R25.2 | R1.2 14.4,36.9 | 14.4,36.9 13.85,36.9 13.85,37.85 R26.2 | C3.2 14,36 14.4,36.4 14.4,36.9
  other vias: 2.97,28.67
  pour Bottom: -5.35,46.65 22.95,46.65 22.95,13.05 29.25,13.05 29.25,-1.55 -5.35,-1.55
  pour Top: -13.65,42.05 22.25,42.05 22.25,-1.95 -13.65,-1.95
GPIO0
  Bottom 0.152: U$3.25 18.51,13.79 18.51,9.97 24.15,4.34 27.96,4.34 28.72,3.57 J7.5
LEAKAGE_IN
  Top 0.305: 2.2,20.45 R7.1
  Top 0.508: T4.3 2.2,20.45
LEAKAGE_OUT  (via drill 0.4)
  Top 0.254: 9.82,25.29 9.36,25.29 v8.83,24.76
  Top 0.381: 9.82,25.29 R12.2
  Bottom 0.254: v8.83,24.76 8.83,24.65 7.54,23.35 7.54,21.02 13.4,15.15 13.4,13.86
  Bottom 0.381: 13.4,13.86 U$3.30
N$1
  Top 0.152: 6.24,18.13 T3.2 | T4.1
  Top 0.381: T4.1 6.24,18.13
N$2
  Top 0.152: 8.3,16.22 R6.1 | 6.32,16.22 T3.1
  Top 0.508: 6.32,16.22 8.3,16.22
N$3
  Top 0.305: T4.2 5.1,21.4 4.05,22.45 Q6.3
  Top 0.508: T4.2 R2.2
N$4
  Bottom 0.2: D2.3 18.75,31.35 17.75,30.35 17.75,29.45 17.23,28.93 15.23,28.93 14.45,28.15 U$3.10
N$5
  Top 0.203: U$1.5 30.95,9.65
  Top 0.254: 30.95,9.65 30.15,10.45 30.15,11.75 29.8,12.1 C4.1 27.7,12.55 R9.2 26.4,12.5 C6.1
N$6
  Top 0.203: U$1.6 30.55,9.45
  Top 0.254: C6.2 25.7,9.45 25.85,9.45 26,9.3 R5.2 26.95,8.35 27.15,8.55 27.15,9.7 C5.1 29.3,10.7 30.55,9.45
N$7
  Top 0.254: U$1.7 30.09,9 C5.2 C7.1 27.35,7.6 R8.2
N$8
  Top 0.305: U$6.3 20.57,22.62 20.35,22.85 20.35,27.65 20.25,27.75 RDOP.2
N$9  (via drill 0.3)
  Top 0.152: 23.08,24.07 U$6.1
  Top 0.305: U$6.1 21.97,23.93 21.75,24.15 21.75,31.45 21.25,31.95 RCOP.2
  Top 0.381: 23.08,24.07 v23.08,24.53
  Bottom 0.152: 32.22,15.77 32.25,15.75
  Bottom 0.203: Q5.4 | 32.28,18.29 32.25,18.25
  Bottom 0.254: 32.22,15.06 32.25,15.09 | 32.25,15.65 32.22,15.77 | v23.08,24.53 22.95,24.45 | 22.95,19.03 22.98,19
  Bottom 0.381: Q5.4 32.35,15.75 32.25,15.75 32.25,18.25 32.25,18.45 32.25,20.25 32.45,20.45 33.95,20.45 34.15,20.65 34.15,25.45 33.95,25.45 33.25,26.14 Q1.4 | Q5.2 32.28,18.29 | 32.25,15.09 32.25,15.65 | 32.22,15.06 24.14,15.06 23.41,15.79 23.41,18.57 22.98,19 | 22.95,24.45 22.95,19.03
N$10  (via drill 0.3)
  Top 0.152: v20.49,28.57 18.81,28.57 18.05,27.81 17.75,27.81 RDOP.1 | v22.93,28.57 24.07,28.57 26.43,26.21 v28.19,26.21
  Bottom 0.152: 28.19,25.9 28.19,25.85
  Bottom 0.203: Q1.2 30.75,26.85 | 27.45,25.86 27.45,25.85
  Bottom 0.381: 30.75,26.85 30.75,26.05 30.55,25.85 28.19,25.85 27.45,25.85 25.15,25.85 24.91,26.09 Q2.2 | Q2.4 27.45,25.86 | v22.93,28.57 v20.49,28.57 | 28.19,25.9 v28.19,26.21
N$11
  Top 0.203: U$1.14 32.55,6.25 33.05,6.25 33.35,6.55 33.35,7.15 33.45,7.25 33.85,7.25 34.15,7.56 R10.1
N$12
  Bottom 0.2: D2.1 22.15,31.35 21.85,31.05 20.05,31.05 18.65,29.65 18.65,29.15 17.65,28.15 16.75,28.15 16.45,27.85 U$3.12
N$13
  Top 0.254: U$1.1 32.55,9.25 33.25,9.95 33.25,10.45 33.47,10.67 C8.1
N$14
  Top 0.203: U$1.3 C9.1
N$15
  Top 0.508: Q3.3 12.6,22.6 R15.1 12.6,25 13.25,25.65 R13.2
N$16
  Top 0.152: 17.44,23.46 17.37,23.54 R16.1 17.29,23.61 | 17.44,21.71 Q4.1 | 16.15,25.6 R13.1
  Top 0.508: 17.44,23.46 17.44,21.71 | 16.15,25.6 16.15,24.76 17.29,23.61
N$17
  Top 0.305: U$6.2 21.22,23.27 21.05,23.45 21.05,29.45 20.65,29.85 RVMP.2
N$18
  Top 0.305: U$6.10 30.57,20.02 RSEL.2
N$19
  Bottom 0.2: U$3.11 15.45,28.15 15.85,28.55 17.45,28.55 18.25,29.35 18.25,30.05 20.45,32.25 D2.2
N$20
  Top 0.305: U$6.4 19.82,21.97 19.4,22.4 RVINI.1
N$21
  Top 0.254: U$6.5 19.32,21.32 19.15,21.15 CDT.2
N$22
  Top 0.254: U$6.6 21.52,20.68 CCT.2
N$23
  Top 0.152: CVSS.1 22.93,25.75 22.93,25.37 26.89,21.4 27,21.3
  Top 0.254: CDT.1 CCT.1 24.2,18.7 24.45,18.95 24.45,20.02
  Top 0.305: RVSS.1 RSEL.1 30.18,21.32 U$6.12 27.02,21.32 27,21.3 25.72,20.02 24.45,20.02 U$6.7
N$25
  Top 0.305: RCTL.1 27.05,18.85 26.85,19.05 26.85,20.35 27.18,20.68 U$6.11
N$26
  Bottom 0.305: Q2.8 24.55,21.42 24.55,22.25 | Q1.7 29.95,21.42 | Q1.7_8 29.75,23.52 27.55,23.52 27.55,22.85 | 31.25,21.15 31.96,21.15 Q1.6 | Q1.5 33.25,21.75 32.75,22.25 | 27.45,16.45 27.82,16.82 Q5.6 Q5.7 | 27.45,16.52 27.45,16.11 Q5.5 | Q5.7 Q5.8 | Q5.7 29.33,18.26 29.92,18.85 | 28.55,22.25 28.55,20.22 29.92,18.85 | Q5.7_8 29.92,18.85
  Bottom 1.016: 24.55,22.25 28.55,22.25 32.75,22.25 32.75,24.65 24.42,24.65 Q2.7_8 24.42,16.45 25.35,16.45 | 24.55,22.25 24.55,22.15 24.55,22.25 | 24.55,22.25 24.55,23.95 31.95,23.95 | 31.95,23.95 31.45,23.95 31.45,22.85 27.55,22.85 25.65,22.85 | 25.65,22.85 25.65,23.15 25.65,22.65 31.25,22.65 31.25,21.15 | 31.25,21.15 31.25,16.45 27.45,16.45 26.45,16.45 | 26.45,16.45 25.35,16.45 | Q2.7 26.85,21.42 | 26.85,21.42 Q2.5 | Q2.5 28.25,21.42 | 28.25,21.42 29.05,21.42 | 29.05,21.42 29.95,21.42 | 29.95,21.42 30.55,21.42 | 30.55,21.42 31.25,21.42 31.25,21.15 | Q5.5_6 27.45,16.52 | 27.45,16.52 Q2.5 | Q5.5_6 28.25,16.52 28.25,21.42 | Q5.5_6 29.05,16.52 29.05,21.42 | Q5.5_6 29.92,18.85 29.92,21.42 29.95,21.42 | Q5.5_6 30.55,16.52 30.55,21.42 | Q2.6 25.35,21.42 25.35,16.45 | 26.45,16.45 26.45,23.52 Q2.5_6 | 25.65,22.85 25.65,16.52 27.45,16.52 | 31.95,23.95 31.95,23.52 | 31.95,23.52 Q1.7_8 | Q1.8 29.05,21.42 | Q2.5 26.85,21.42 | Q1.5_6 31.95,23.52
  Bottom 2.54: Q2.5_6 29.75,23.52
N$27
  Top 0.254: U$6.13 29.47,21.97 30.15,22.65 30.15,23.25 30.85,23.95 CVC3.1
  Top 0.305: CVC3.1 32.3,23.05 34.1,23.05 RVC3.1
N$28
  Top 0.254: 33.25,24.85 33.23,24.83 30.63,24.83 30.45,24.65 30.45,24.25 29.65,23.45 29.65,22.85 29.43,22.62 U$6.14
  Top 0.305: CVC2.1 33.25,24.85 | 33.25,24.85 33.25,24.1 CVC3.2 | RVC2.1 35.3,24.85 33.25,24.85
N$29
  Top 0.305: U$6.15 27.52,23.27 27.25,23.55 27.25,25.4
  Top 0.508: CVSS.2 25.15,25.4 27.25,25.4 | 27.25,25.4 RVC1.1 27.25,25.4 | CVC2.2 30.65,26.35 30.25,26.35 29.9,26 29.3,25.4 CVC1.1 27.25,25.4
N$31
  Bottom 0.508: R26.1 17.55,37.35 D2.4
N$32
  Top 0.305: R14.2 R27.2
  Top 0.508: Q3.2 R14.2
N$33
  Bottom 0.508: R25.1 23.35,37.35 D2.6
N$34
  Bottom 0.508: R24.1 20.45,38.45 D2.5
OUT-
  Top 0.152: U$2.8 22.02,7.54 22.05,7.75 | U$2.9 18.81,10.05 15.92,10.05 15.61,9.75 15.16,9.75 13.48,11.42 13.48,16.76 12.79,17.44 R14.1
  Top 0.305: 12.5,17.85 12.5,17.75 R14.1 | R18.2 10.9,17.85
  Top 0.508: 18.46,8.14 U$2.9 20.15,9.45 18.65,7.95 18.65,5.05 21.35,5.05 21.45,4.95 21.55,5.05 21.55,7.95 | 18.46,8.14 18.25,7.92 18.25,7.55 | 18.25,7.55 18.25,4.15 21.15,4.15 22.05,5.05 22.05,7.35 | 22.05,7.35 22.05,7.75 | 22.05,7.75 22.05,8.15 21.85,7.95 | 21.85,7.95 21.55,7.95 | 21.55,7.95 21.15,7.55 U$2.7 | 21.85,7.95 22.05,7.75 | 22.05,7.75 22.05,7.35 | U$2.6 18.97,8.14 18.46,8.14 | U$2.5 18.25,7.55 | Q3.1 12.5,17.85 10.9,17.85
  Top 2.8: U$2.9 20.15,4.75 J4.1
OUT_BASE
  Top 0.305: U$2.4 18.29,12.48 18.2,12.4 R20.1 R19.1
OUT_CONTROL  (via drill 0.3)
  Top 0.152: v12.41,12.41 12.41,12.03 15.08,9.36 16.53,9.36 R19.2
  Bottom 0.152: v12.41,12.41 12.41,13.79 U$3.31
RST  (via drill 0.3, 0.8)
  Top 0.152: v7.43,28.66 5.58,26.81 5.4,26.81 4.11,25.52 v4.11,25.29 | v4.87,12.26 5.17,12.26 7.23,10.2 8.6,10.2 8.83,10.43 10.51,10.43 12.56,8.38 12.56,8.15 18.89,1.82 v25.75,1.82
  Bottom 0.152: v7.43,28.66 7.38,28.71 7.45,28.64 7.45,27.15 7.38,26.89 U$3.3 | v4.11,25.29 4.11,14.33 4.03,14.26 4.03,13.1 v4.87,12.26 | v25.75,1.82 27.43,3.5 J7.4
RT
  Bottom 0.305: U3.10 12.15,33.85 12.15,34.6 R1.1
RX
  Bottom 0.152: U$3.34 9.52,13.79 9.52,13.02 10.24,12.3 10.39,12.3 12.79,9.9 12.79,8.07 14.7,6.16 21.02,6.16 23.61,3.57 J7.1
SCL  (via drill 0.3)
  Top 0.152: v30.78,4.41 30.85,4.41 30.95,4.45 | v28.72,2.35 18.81,2.35 15.77,5.4 v15.77,7.69 15.54,7.69 12.49,10.74 v7.99,10.74
  Top 0.203: U$1.11 31.35,4.85 30.95,4.45
  Bottom 0.152: U$3.36 7.38,13.79 7.38,11.8 R22.1 7.46,11.73 7.46,11.27 v7.99,10.74 | v28.72,2.35 v30.78,4.41 | v15.77,7.69 14.62,8.83 U2.6
SDA  (via drill 0.3, 0.4)
  Top 0.152: v25.44,5.02 24.99,5.48 24.99,9.21 24.53,9.67 24.07,9.67 23.05,10.69 23.05,11.15 22.32,11.88 17.59,11.88 v17.52,11.8
  Top 0.203: U$1.12 31.75,5.35 31.95,5.15 32.65,5.15 33.95,6.45 v33.95,6.55
  Bottom 0.152: R21.1 13.33,11.57 13.33,8.91 U2.5 | v25.44,5.02 25.82,4.64 30.19,4.64 32.09,6.55 33.9,6.55 v33.95,6.55 | v17.52,11.8 16.22,11.8 15.54,12.49 14.32,12.49 13.4,11.57 R21.1 | U$3.33 10.51,13.79 10.51,13.02 11.88,11.65 13.25,11.65 R21.1
SW  (via drill 0.8)
  Top 1.27: v10.35,29.15 v7.65,32.05
  Bottom 0.381: U3.6 12.35,31.85 12.25,31.75 12.25,31.09 11.35,30.19 C2.2
  Bottom 0.813: L1.P$1 7.65,33.05 v7.65,32.05 | C2.2 10.45,30.05 10.45,29.15 v10.35,29.15
THERMISTOR
  Top 0.203: U$1.9 30.55,4.95 30.25,4.65 30.25,3.95 30.45,3.75 31.25,3.75 32.15,4.65 32.85,4.65 35.35,7.15 35.35,9.15 35.05,9.45 | 35.05,9.45 R10.2 | 35.05,9.45 39.05,13.45 39.05,23.15 38.09,24.11 J8.3
TX
  Bottom 0.152: U$3.35 8.38,13.79 8.38,12.71 8.3,12.64 8.3,11.12 8.98,10.43 10.51,10.43 12.39,8.55 12.39,8.02 16.15,4.26 17.52,4.26 17.75,4.03 17.75,3.42 18.81,2.35 23.77,2.35 24.91,3.5 J7.2
VDD  (via drill 0.4, 0.8)
  Top 0.381: v16.53,7.84 16.07,8.3 15.54,8.3 12.57,11.27 v10.66,11.27 10.51,11.35 6.7,11.35 4.72,13.33 v4.56,13.33 | v17.44,16.98 16.6,16.15 R17.1 | v5.85,22.42 v9.72,22.42 | 6.32,28.41 6.2,28.3 | 6.2,28.3 2.05,24.15 2.05,22.02 R7.2 | 9.29,33.75 v9.65,33.95 | v6.16,28.34 6.2,28.3 | v38.85,25.55 38.85,27.55 35.85,30.55 35.85,31.25
  Top 0.406: v30.75,36.85 32.25,35.35 33.55,35.35 35.85,33.05 35.85,31.25
  Top 0.61: 6.32,28.41 6.32,29.05 7,29.73 7,30.82 6.27,31.54 6.27,32.41 7.61,33.75 9.29,33.75
  Top 0.813: 16.05,33.95 16.55,34.45 v16.55,34.25
  Top 1.27: v9.65,33.95 16.05,33.95
  Bottom 0.381: U3.2 16.05,33.35 16.35,33.65 | U3.8 11.75,32.85 L1.P$2 | v10.66,11.27 10.2,11.73 9.14,11.73 R22.2 | v16.53,7.84 16.53,8.22 17.14,8.83 U2.8 17.06,8.98 17.06,9.52 15,11.57 R21.2 | v17.44,16.98 17.44,23.23 17.06,23.61 10.91,23.61 v9.72,22.42 | v4.56,13.33 4.56,21.06 5.87,22.37 v5.85,22.42 5.85,25.12 6.47,25.9 6.47,26.81 U$3.2 6.32,26.97 6.32,28.19 v6.16,28.34 | 30.64,36.8 23.69,36.8 22.78,35.88 16.76,35.88 C3.1 | 37.41,20.34 J8.6 38.85,21.7 v38.85,25.55
  Bottom 0.406: U3.1 16.55,33.85 | 30.64,36.8 30.65,36.89 v30.75,36.85
  Bottom 0.508: C3.1 v16.55,34.25 16.55,33.85 16.35,33.65
  Bottom 0.813: R23.2 8.95,31.45 10.15,32.65 L1.P$2 10.05,33.55 v9.65,33.95
WTR-SENS  (via drill 0.3)
  Top 0.152: 8.38,17.98 R6.2 | 8.38,19.65 R2.1 8.38,19.73 8.38,20.03 10.66,22.32 10.66,24.22 10.56,24.33 9.17,24.33 8.99,24.15 8.65,24.15 8.45,24.35 5.45,24.35 5.35,24.43 4.64,25.14 4.64,25.6 5.55,26.51 8.76,26.51 10.51,28.26 16.23,28.26 16.79,28.82 18.32,28.82 18.56,29.06 18.56,32.81 18.71,32.96 25.03,32.96 29.45,28.55 31.94,28.55 32.47,28.02 37.11,28.02 38.25,26.89 v38.25,25.98
  Top 0.381: 8.38,19.65 8.38,17.98
  Bottom 0.152: v38.25,25.98 38.25,22.4 37.48,21.63 J8.5
WTR_MEASURE_ON1
  Top 0.152: 6.16,23.54 Q6.1 | 7.69,23.54 R11.2 7.76,23.61 | 9.82,23.61 R12.1
  Top 0.508: 7.69,23.54 6.16,23.54 | 7.76,23.61 9.82,23.61
WTR_MEASURE_PULLUP1
  Top 0.305: 2.1,17.15 R4.1
  Top 0.508: T3.3 2.1,17.15

### Text on the board
tPlace: DiveTeam | v6.0 | OUT+ | BATT+ | BATT- | OUT-